# Altium project PROC114E3_SCH.PrjPcb (part 12 of 22)

## Sheet 26.SchDoc
size 513 x 386 mm
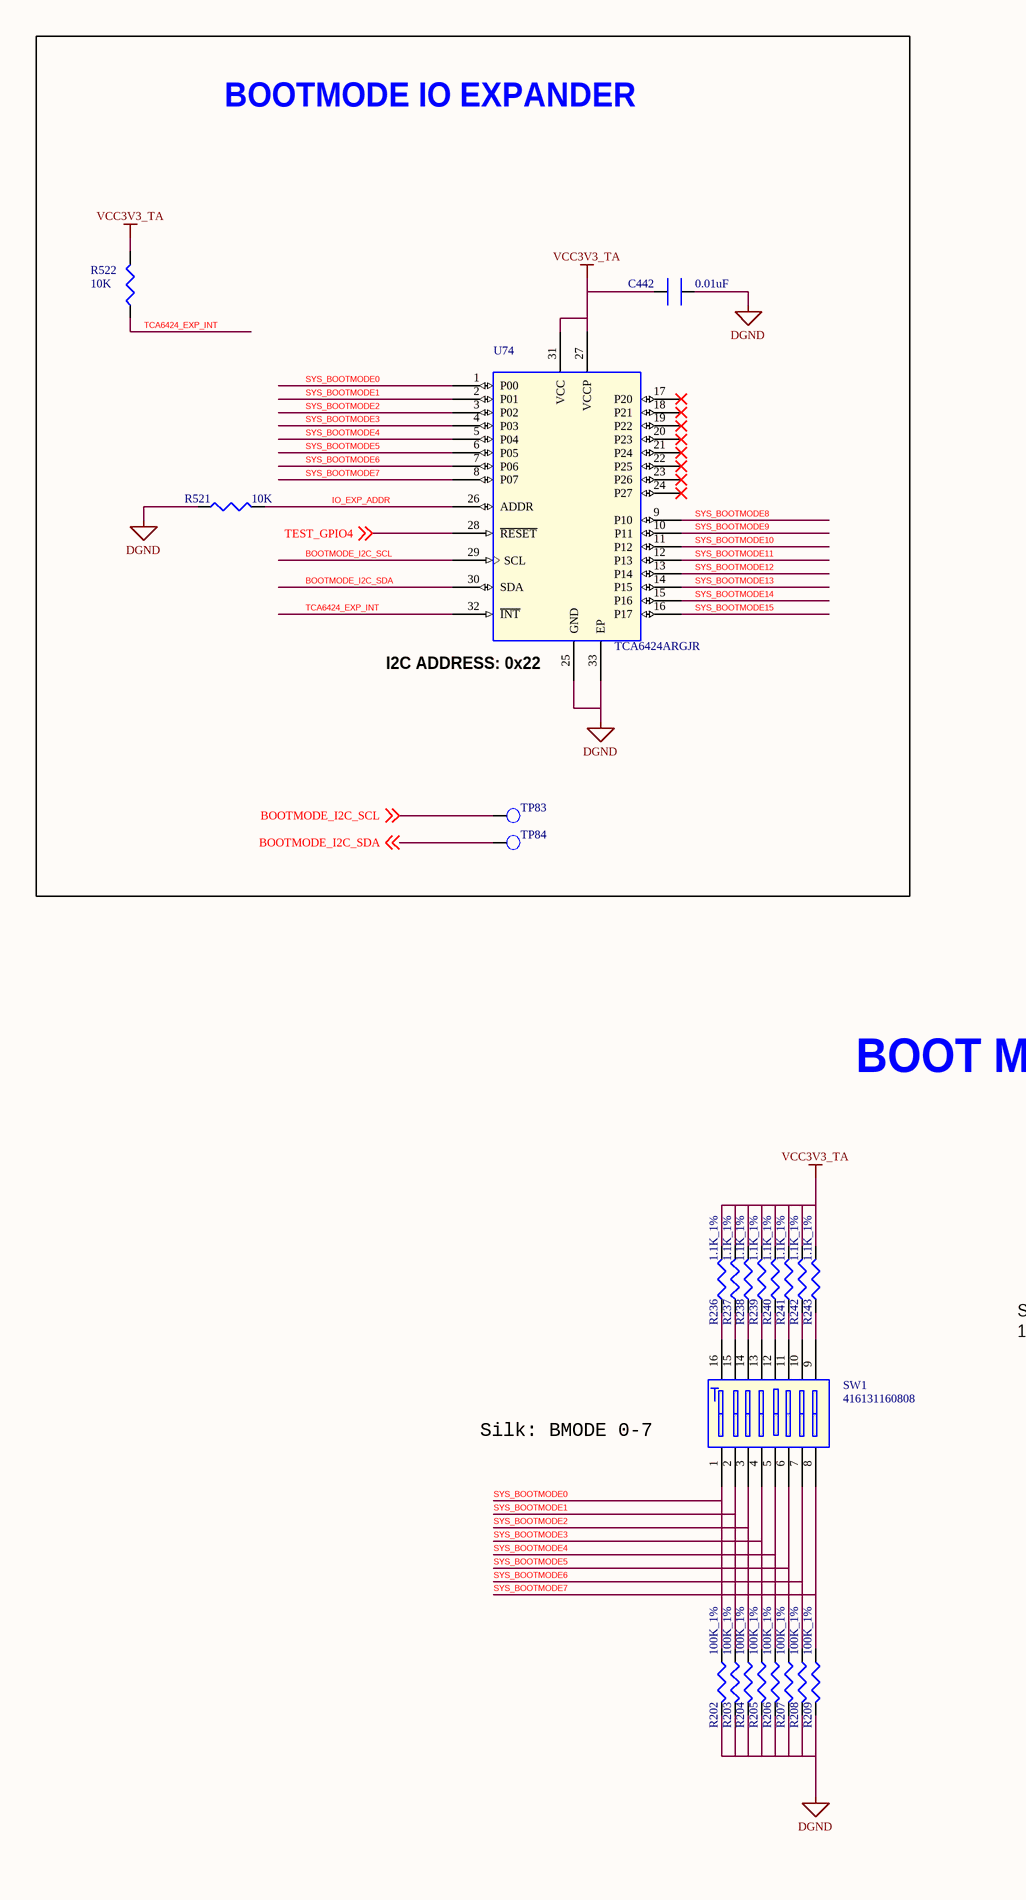
[diagram p41: 26.SchDoc, left]
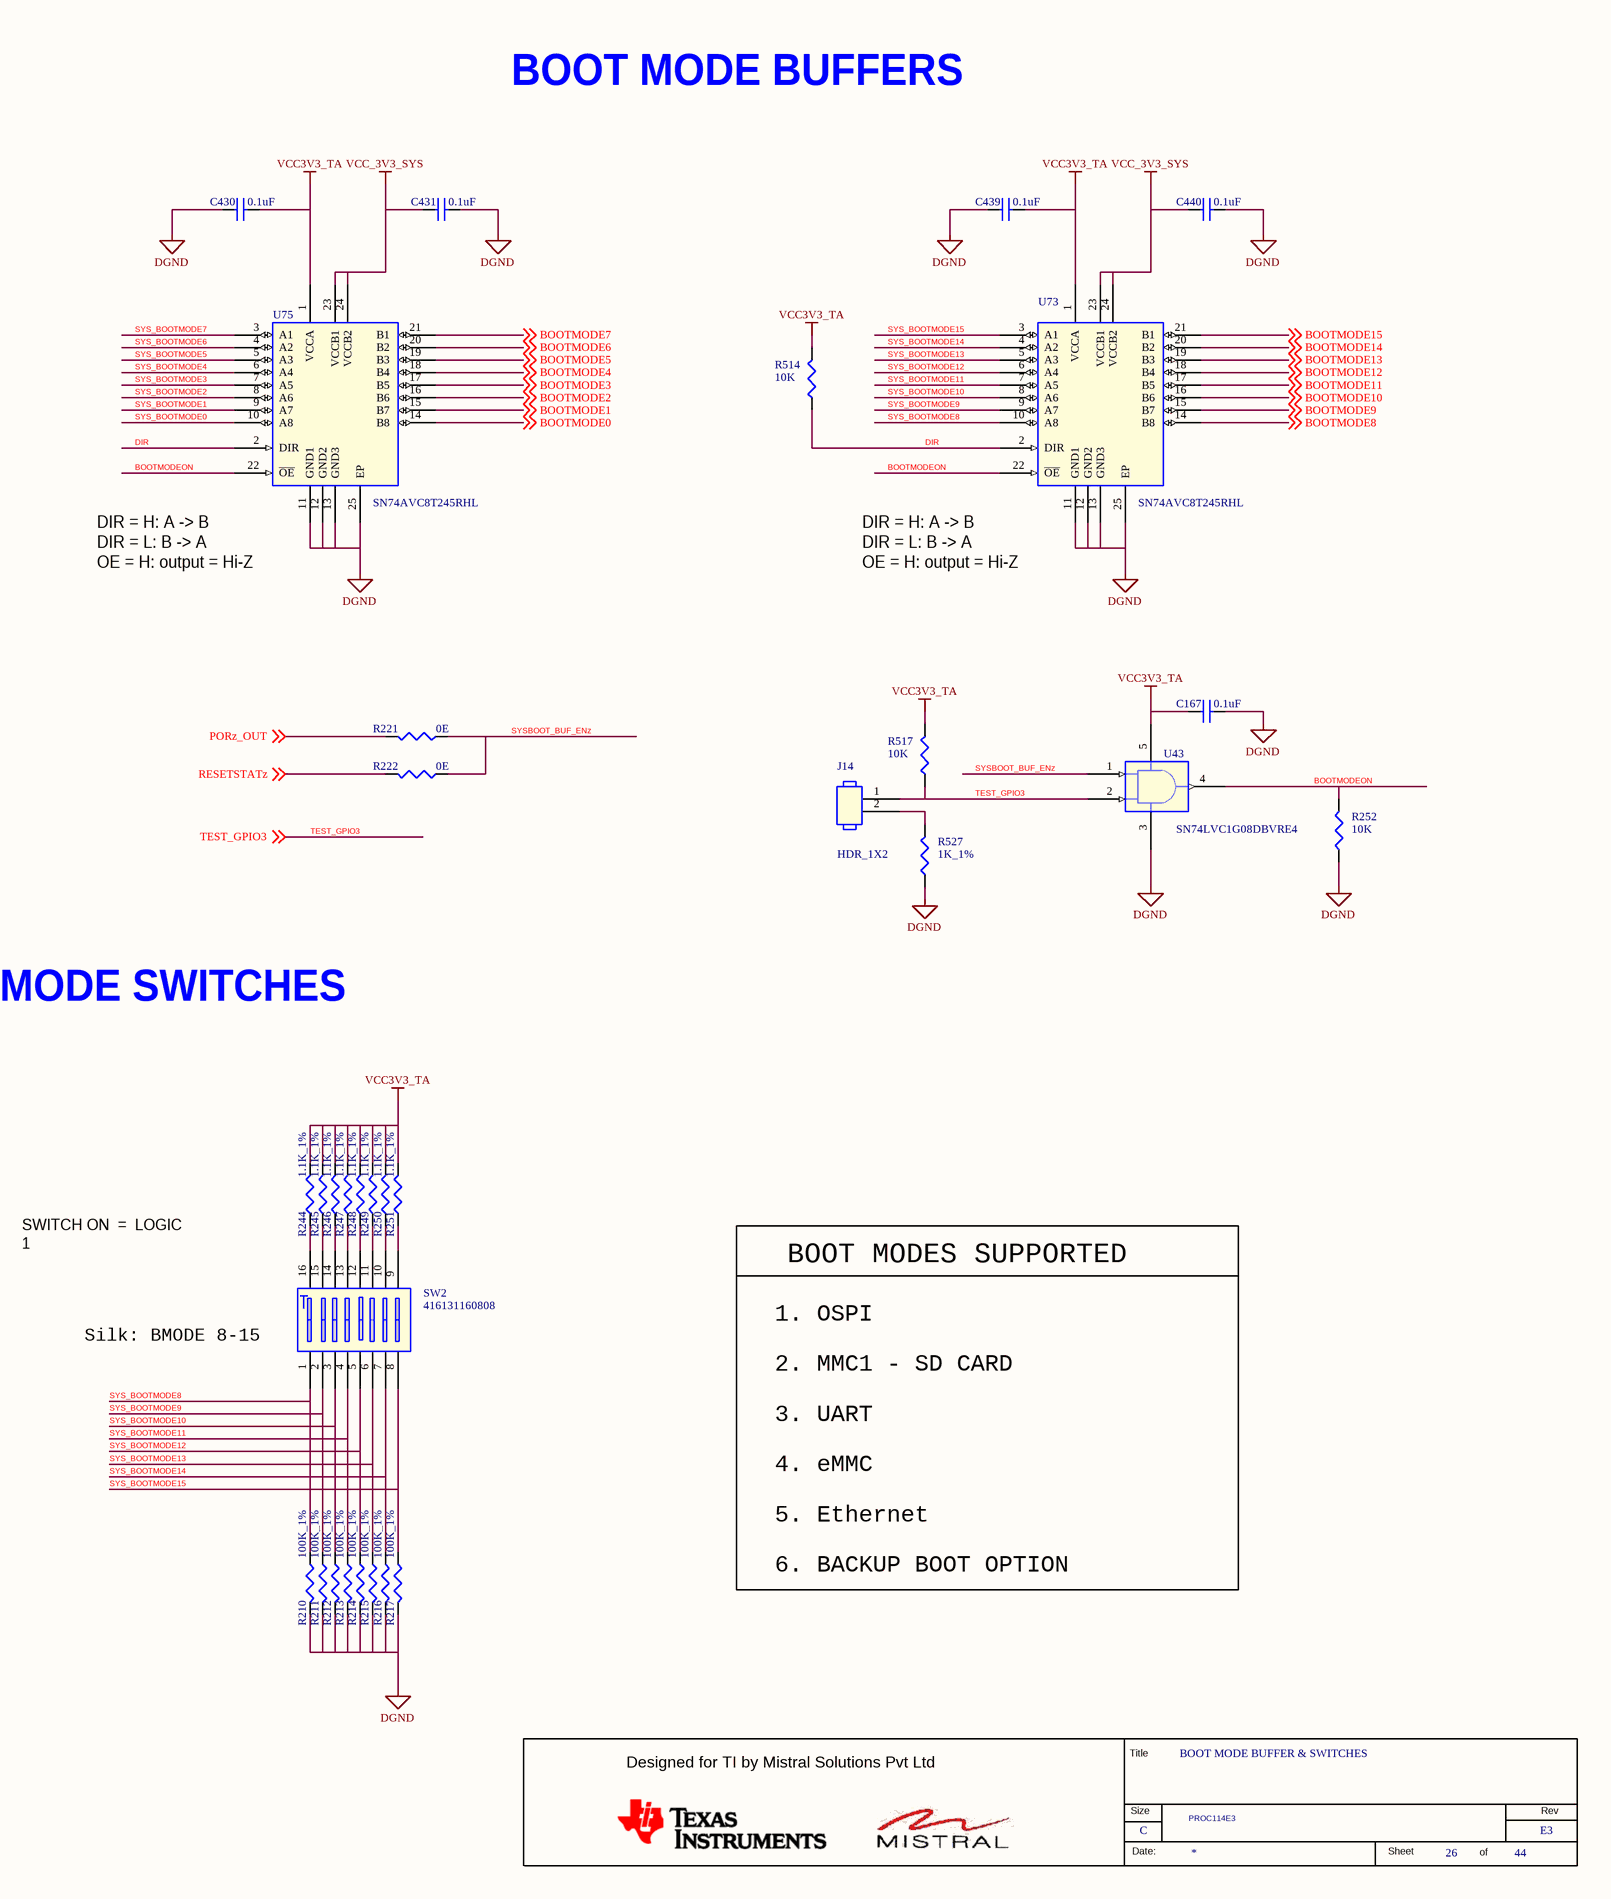
[diagram p42: 26.SchDoc, right]

### Parts
(Parts that share a designator on the sheet are numbered #1, #2 ... from top to bottom, then left to right.)
*#26  RevCode: E3  Title: BOOT MODE BUFFER & SWITCHES  Page Size: C  Page Number: 26  Page Count: 44  Variant Name: PROC114E3  (hidden comment: MISTRAL_TITLEBLK_CSIZE)  (graphical)
C167  0.1uF  [CAP0201_0-5]
C430  0.1uF  [CAP0201_0-5]
C431  0.1uF  [CAP0201_0-5]
C439  0.1uF  [CAP0201_0-5]
C440  0.1uF  [CAP0201_0-5]
C442  0.01uF  [CAP0402N]
J14  HDR_1X2  [HDR_1X2_90120-0122_S_T_5-6]
R202  100K_1%  [RES0201_0-5]
R203  100K_1%  [RES0201_0-5]
R204  100K_1%  [RES0201_0-5]
R205  100K_1%  [RES0201_0-5]
R206  100K_1%  [RES0201_0-5]
R207  100K_1%  [RES0201_0-5]
R208  100K_1%  [RES0201_0-5]
R209  100K_1%  [RES0201_0-5]
R210  100K_1%  [RES0201_0-5]
R211  100K_1%  [RES0201_0-5]
R212  100K_1%  [RES0201_0-5]
R213  100K_1%  [RES0201_0-5]
R214  100K_1%  [RES0201_0-5]
R215  100K_1%  [RES0201_0-5]
R216  100K_1%  [RES0201_0-5]
R217  100K_1%  [RES0201_0-5]
R221  0E  [RES0201_0-5]
R222  0E  [RES0402_0-5]
R236  1.1K_1%  [RES0201_0-5]
R237  1.1K_1%  [RES0201_0-5]
R238  1.1K_1%  [RES0201_0-5]
R239  1.1K_1%  [RES0201_0-5]
R240  1.1K_1%  [RES0201_0-5]
R241  1.1K_1%  [RES0201_0-5]
R242  1.1K_1%  [RES0201_0-5]
R243  1.1K_1%  [RES0201_0-5]
R244  1.1K_1%  [RES0201_0-5]
R245  1.1K_1%  [RES0201_0-5]
R246  1.1K_1%  [RES0201_0-5]
R247  1.1K_1%  [RES0201_0-5]
R248  1.1K_1%  [RES0201_0-5]
R249  1.1K_1%  [RES0201_0-5]
R250  1.1K_1%  [RES0201_0-5]
R251  1.1K_1%  [RES0201_0-5]
R252  10K  [RES0201_0-5]
R514  10K  [RES0201_0-5]
R517  10K  [RES0201_0-5]
R521  10K  [RES0201_0-5]
R522  10K  [RES0201_0-5]
R527  1K_1%  [RES0402_0-5]
SW1  416131160808  [SW16_416131160808_460X230_SMD_2-7]
SW2  416131160808  [SW16_416131160808_460X230_SMD_2-7]
TP83  TP20_SMD  [TP20_SMD]  (value not drawn)
TP84  TP20_SMD  [TP20_SMD]  (value not drawn)
U43  SN74LVC1G08DBVRE4  [SOT23-5]
U73  SN74AVC8T245RHL  [QFN24_19-68_220X140_1]
U74  TCA6424ARGJR  [QFN32_19-68_200X200]
U75  SN74AVC8T245RHL  [QFN24_19-68_220X140_1]

### Blocks framed on the sheet
BOOTMODE IO EXPANDER: C442 R521 R522 TP83 TP84 U74

### Nets
DGND: C167.2 C430.1 C431.2 C439.1 C440.2 C442.1 R202.2 R203.2 R204.2 R205.2 R206.2 R207.2 R208.2 R209.2 R210.2 R211.2 R212.2 R213.2 R214.2 R215.2 R216.2 R217.2 R252.1 R521.2 R527.1 U43.3(GND) U73.11(GND1) U73.12(GND2) U73.13(GND3) U73.25(EP) U74.25(GND) U74.33(EP) U75.11(GND1) U75.12(GND2) U75.13(GND3) U75.25(EP)
VCC3V3_TA: C167.1 C430.2 C439.2 C442.2 R236.2 R237.2 R238.2 R239.2 R240.2 R241.2 R242.2 R243.2 R244.2 R245.2 R246.2 R247.2 R248.2 R249.2 R250.2 R251.2 R514.2 R517.2 R522.2 U43.5(VCC) U73.1(VCCA) U74.27(VCCP) U74.31(VCC) U75.1(VCCA)
VCC_3V3_SYS: C431.1 C440.1 U73.23(VCCB1) U73.24(VCCB2) U75.23(VCCB1) U75.24(VCCB2)
BOOTMODE0: U75.14(B8) ; off-sheet BOOTMODE0
BOOTMODE1: U75.15(B7) ; off-sheet BOOTMODE1
BOOTMODE2: U75.16(B6) ; off-sheet BOOTMODE2
BOOTMODE3: U75.17(B5) ; off-sheet BOOTMODE3
BOOTMODE4: U75.18(B4) ; off-sheet BOOTMODE4
BOOTMODE5: U75.19(B3) ; off-sheet BOOTMODE5
BOOTMODE6: U75.20(B2) ; off-sheet BOOTMODE6
BOOTMODE7: U75.21(B1) ; off-sheet BOOTMODE7
BOOTMODE8: U73.14(B8) ; off-sheet BOOTMODE8
BOOTMODE9: U73.15(B7) ; off-sheet BOOTMODE9
BOOTMODE10: U73.16(B6) ; off-sheet BOOTMODE10
BOOTMODE11: U73.17(B5) ; off-sheet BOOTMODE11
BOOTMODE12: U73.18(B4) ; off-sheet BOOTMODE12
BOOTMODE13: U73.19(B3) ; off-sheet BOOTMODE13
BOOTMODE14: U73.20(B2) ; off-sheet BOOTMODE14
BOOTMODE15: U73.21(B1) ; off-sheet BOOTMODE15
BOOTMODE_I2C_SCL: TP83.1(TP) U74.29(SCL) ; off-sheet BOOTMODE_I2C_SCL
BOOTMODE_I2C_SDA: TP84.1(TP) U74.30(SDA) ; off-sheet BOOTMODE_I2C_SDA
BOOTMODEON: R252.2 U43.4(Y) U73.22(~{OE}) U75.22(~{OE})
DIR: R514.1 U73.2(DIR) U75.2(DIR)
IO_EXP_ADDR: R521.1 U74.26(ADDR)
PORz_OUT: R221.2 ; off-sheet PORz_OUT
RESETSTATz: R222.2 ; off-sheet RESETSTATz
SYS_BOOTMODE0: R202.1 SW1.1 U74.1(P00) U75.10(A8)
SYS_BOOTMODE1: R203.1 SW1.2 U74.2(P01) U75.9(A7)
SYS_BOOTMODE2: R204.1 SW1.3 U74.3(P02) U75.8(A6)
SYS_BOOTMODE3: R205.1 SW1.4 U74.4(P03) U75.7(A5)
SYS_BOOTMODE4: R206.1 SW1.5 U74.5(P04) U75.6(A4)
SYS_BOOTMODE5: R207.1 SW1.6 U74.6(P05) U75.5(A3)
SYS_BOOTMODE6: R208.1 SW1.7 U74.7(P06) U75.4(A2)
SYS_BOOTMODE7: R209.1 SW1.8 U74.8(P07) U75.3(A1)
SYS_BOOTMODE8: R210.1 SW2.1 U73.10(A8) U74.9(P10)
SYS_BOOTMODE9: R211.1 SW2.2 U73.9(A7) U74.10(P11)
SYS_BOOTMODE10: R212.1 SW2.3 U73.8(A6) U74.11(P12)
SYS_BOOTMODE11: R213.1 SW2.4 U73.7(A5) U74.12(P13)
SYS_BOOTMODE12: R214.1 SW2.5 U73.6(A4) U74.13(P14)
SYS_BOOTMODE13: R215.1 SW2.6 U73.5(A3) U74.14(P15)
SYS_BOOTMODE14: R216.1 SW2.7 U73.4(A2) U74.15(P16)
SYS_BOOTMODE15: R217.1 SW2.8 U73.3(A1) U74.16(P17)
SYSBOOT_BUF_ENz: R221.1 R222.1 U43.1(A)
TCA6424_EXP_INT: R522.1 U74.32(~{INT})
TEST_GPIO3: J14.1 R517.1 U43.2(B) ; off-sheet TEST_GPIO3
TEST_GPIO4: U74.28(~{RESET}) ; off-sheet TEST_GPIO4
NetJ14_2: J14.2 R527.2
NetR236_1: R236.1 SW1.16
NetR237_1: R237.1 SW1.15
NetR238_1: R238.1 SW1.14
NetR239_1: R239.1 SW1.13
NetR240_1: R240.1 SW1.12
NetR241_1: R241.1 SW1.11
NetR242_1: R242.1 SW1.10
NetR243_1: R243.1 SW1.9
NetR244_1: R244.1 SW2.16
NetR245_1: R245.1 SW2.15
NetR246_1: R246.1 SW2.14
NetR247_1: R247.1 SW2.13
NetR248_1: R248.1 SW2.12
NetR249_1: R249.1 SW2.11
NetR250_1: R250.1 SW2.10
NetR251_1: R251.1 SW2.9

Not connected (* = marked no-connect by the designer): U74 17(P20)* 18(P21)* 19(P22)* 20(P23)* 21(P24)* 22(P25)* 23(P26)* 24(P27)*

### Notes on the sheet
- BOOT MODE BUFFERS
- (near U75) DIR = H: A -> B
  DIR = L: B -> A
  OE = H: output = Hi-Z
- (near U73) DIR = H: A -> B
  DIR = L: B -> A
  OE = H: output = Hi-Z
- (near U74) I2C ADDRESS: 0x22
- BOOT MODE SWITCHES
- SWITCH ON  =  LOGIC 1
  SWITCH OFF =  LOGIC 0
- BOOT MODES SUPPORTED
- 1. OSPI
- Silk: BMODE 0-7
- Silk: BMODE 8-15
- 2. MMC1 - SD CARD
- 3. UART
- 4. eMMC
- 5. Ethernet
- 6. BACKUP BOOT OPTION
- (in symbol MISTRAL_TITLEBLK_CSIZE) Title; Designed for TI by Mistral Solutions Pvt Ltd; Size; Rev; Date:; Sheet; of

### Library data of the parts
*#26 = MISTRAL_TITLEBLK_CSIZE: Issue: 1.0; Page Create Date: March  8, 1995; Page Modify Date: *; Schematic Page Count: 44; Schematic Page Number: 26
C167 C430 C431 C440 = CAP_Dup2: as C325 on sheet 24; Tolerance: 10%; Voltage: 16V; Package: 0201; Distributor_name: DIGIKEY; Distributor_part_number: 490-14305-1-ND; Height: 0.33MM; Weight: 0.33mg; Temperature: -55°C+85°C; Datasheet: Y:\MIS_DATABASE\DATASHEETS\CAPACITORS\GRM033R61C104KE14.PDF; Crtd /date: MANIRAJA/230118; Chkd/date: MANIRAJA/230118; MECHANICAL 3D STEP FILE: CAP0201_0-5; Library Ref: CAP; Footprint Ref: CAP0201_0-5; Library Path: Y:\MIS_DATABASE\Library\ALTIUM_TOOL\SCHEMATICS_PARTS\MS_DISCRETE_Library.schlib; Footprint Path: Y:\MIS_DATABASE\Library\ALTIUM_TOOL\PCB_FOOTPRINTS\Altium_Footprint_Lib.PcbLib; PCB Footprint: CAP0201_0-5
C439 = CAP_Dup2: as C474 on sheet 25; Footprint Path: Y:\MIS_DATABASE\Library\ALTIUM_TOOL\PCB_FOOTPRINTS\Altium_Footprint_Lib.PcbLib; Library Path: Y:\MIS_DATABASE\Library\ALTIUM_TOOL\SCHEMATICS_PARTS\MS_DISCRETE_Library.schlib; Footprint Ref: CAP0201_0-5; Library Ref: CAP; MECHANICAL 3D STEP FILE: CAP0201_0-5; Chkd/date: MANIRAJA/230118; Crtd /date: MANIRAJA/230118; Datasheet: Y:\MIS_DATABASE\DATASHEETS\CAPACITORS\GRM033R61C104KE14.PDF; Temperature: -55°C+85°C; Weight: 0.33mg; Height: 0.33MM; Distributor_part_number: 490-14305-1-ND; Distributor_name: DIGIKEY; Package: 0201; Voltage: 16V; Tolerance: 10%; PCB Footprint: CAP0201_0-5
C442 = CAP_Dup3: CAP CERAMIC 0.01uF 25V 10% X5R 0201; Part_type: CAPACITORS\CERAMIC; Mfr_part_number: GRM033R61E103KA12J; Mfr_name: MURATA; Mistral Part No: 120018010007-R; PCB Footprint: CAP0201_0-5; Wattage: NA; Custom_Duty: 15%; Customs_HS_Code: 85322990; Project: TI_MAXIE_CPB; Footprint Path: Y:\MIS_DATABASE\Library\ALTIUM_TOOL\PCB_FOOTPRINTS\Altium_Footprint_Lib.PcbLib; Library Path: Y:\MIS_DATABASE\Library\ALTIUM_TOOL\SCHEMATICS_PARTS\MS_DISCRETE_Library.schlib; Footprint Ref: CAP0201_0-5; MECHANICAL 3D STEP FILE: CAP0201_0-5; Temperature: -55°C+85°C; Weight: 0.33mg; Chkd/date: MANIRAJA/230118; Crtd /date: MANIRAJA/230118; Datasheet: Y:\MIS_DATABASE\DATASHEETS\CAPACITORS\GRM033R61E103KA12.PDF; Height: 0.33MM; Distributor_part_number: GRM033R61E103KA12J-ND; Distributor_name: DIGIKEY; Package: 0201; Voltage: 25V; Tolerance: 10%; Library Ref: CAP
J14 = HEADER_2X1: CON HDR 1X2 2.54MM PITCH ST TH; Mistral Part No: 150012100005-R; Mfr_name: MOLEX; Mfr_part_number: 90120-0122; Part_type: CONNECTOR\HEADERS; Wattage: NA; Project: NPOL_FEP; Customs_HS_Code: 85369090; Custom_Duty: 24%; PCB Footprint: HDR_1X2_90120-0122_S_T_5-6; Footprint Ref: HDR_1X2_90120-0122_S_T_5-6; Library Ref: HEADER_2X1; Footprint Path: Y:\MIS_DATABASE\Library\ALTIUM_TOOL\PCB_FOOTPRINTS\Altium_Footprint_Lib.PcbLib; Library Path: Y:\MIS_DATABASE\Library\ALTIUM_TOOL\SCHEMATICS_PARTS\MS_CONNECTOR_Library.schlib; MECHANICAL 3D STEP FILE: HDR_1X2_90120-0122_S_T_5-6; Temperature: -55°C+125°C; Weight: 122mg; Voltage: NA; Tolerance: NA; Package: THRU-HOLE; Distributor_name: DIGIKEY; Distributor_part_number: WM8072-ND; Height: 5.60MM; Datasheet: Y:\MIS_DATABASE\DATASHEETS\CONNECTORS\90120-XX.PDF; Crtd /date: USMAN/031012; Chkd/date: NAVEED/210714
R202 R203 R205 R206 R208 R210 R212 R214 R217 = RESISTOR_Dup4: RES 100K 1/20W 1% 0201; Mistral Part No: 110009060005-R; Mfr_name: YAGEO AMERICA; Mfr_part_number: RC0201FR-07100KL; Part_type: RESISTORS\FIXED; Project: SD865_NANOSOM; Voltage: NA; Customs_HS_Code: 85332119; Custom_Duty: 15%; Footprint Path: Y:\MIS_DATABASE\Library\ALTIUM_TOOL\PCB_FOOTPRINTS\Altium_Footprint_Lib.PcbLib; Library Path: Y:\MIS_DATABASE\Library\ALTIUM_TOOL\SCHEMATICS_PARTS\MS_DISCRETE_Library.schlib; Footprint Ref: RES0201_0-5; Library Ref: RESISTOR; MECHANICAL 3D STEP FILE: RES0201_0-5; Tolerance: 1%; Wattage: 1/20W; Package: 0201; Distributor_name: DIGIKEY; Distributor_part_number: 311-100KMCT-ND; Height: 0.26MM; Weight: 9mg; Temperature: -55°C+125°C; Datasheet: Y:\MIS_DATABASE\DATASHEETS\RESISTORS\RCXXXXL-SER_MAR18.PDF; Crtd /date: ALVY/120520; Chkd/date: MANIRAJA/120520; PCB Footprint: RES0201_0-5
R204 R207 R209 R211 R213 R215 R216 = RESISTOR_Dup4: RES 100K 1/20W 1% 0201; Part_type: RESISTORS\FIXED; Mfr_part_number: RC0201FR-07100KL; Mfr_name: YAGEO AMERICA; Mistral Part No: 110009060005-R; Custom_Duty: 15%; Customs_HS_Code: 85332119; Voltage: NA; Project: SD865_NANOSOM; Chkd/date: MANIRAJA/120520; Crtd /date: ALVY/120520; Datasheet: Y:\MIS_DATABASE\DATASHEETS\RESISTORS\RCXXXXL-SER_MAR18.PDF; Temperature: -55°C+125°C; Weight: 9mg; Height: 0.26MM; Distributor_part_number: 311-100KMCT-ND; Distributor_name: DIGIKEY; Package: 0201; Wattage: 1/20W; Tolerance: 1%; MECHANICAL 3D STEP FILE: RES0201_0-5; Library Ref: RESISTOR; Footprint Ref: RES0201_0-5; Library Path: Y:\MIS_DATABASE\Library\ALTIUM_TOOL\SCHEMATICS_PARTS\MS_DISCRETE_Library.schlib; Footprint Path: Y:\MIS_DATABASE\Library\ALTIUM_TOOL\PCB_FOOTPRINTS\Altium_Footprint_Lib.PcbLib; PCB Footprint: RES0201_0-5
R221 = RESISTOR_Dup4: RES 0E 1/20W 5% 0201; Part_type: RESISTORS\FIXED; Mfr_part_number: RC0201JR-070RL; Mfr_name: YAGEO AMERICA; Mistral Part No: 110010070067-R; Custom_Duty: 15%; Customs_HS_Code: 85332119; Voltage: NA; Project: PB_BUGBASE; MECHANICAL 3D STEP FILE: RES0201_0-5; Chkd/date: NAVEED/301214; Crtd /date: MUDDU/120710; Datasheet: Y:\MIS_DATABASE\DATASHEETS\RESISTORS\RCXXXXL-SER_MAR18.PDF; Temperature: -55°C+125°C; Weight: 0.17mg; Height: 0.26MM; Distributor_part_number: 311-0.0NCT-ND; Distributor_name: DIGIKEY; Package: 0201; Wattage: 1/20W; Tolerance: 5%; Library Ref: RESISTOR; Footprint Ref: RES0201_0-5; Library Path: Y:\MIS_DATABASE\Library\ALTIUM_TOOL\SCHEMATICS_PARTS\MS_DISCRETE_Library.schlib; Footprint Path: Y:\MIS_DATABASE\Library\ALTIUM_TOOL\PCB_FOOTPRINTS\Altium_Footprint_Lib.PcbLib; PCB Footprint: RES0201_0-5
R222 = RESISTOR_Dup4: as R610 on sheet 25; MECHANICAL 3D STEP FILE: RES0402_0-5; Chkd/date: VASANTHA/201216; Crtd /date: MUDDU/190810; Datasheet: Y:\MIS_DATABASE\DATASHEETS\RESISTORS\CRCW0603.PDF; Temperature: -55°C+155°C; Weight: 0.65mg; Height: 0.40MM; Distributor_part_number: 541-0.0JCT-ND; Distributor_name: DIGIKEY; Package: 0402; Wattage: 1/16W; Tolerance: NA; Library Ref: RESISTOR; Footprint Ref: RES0402_0-5; Library Path: Y:\MIS_DATABASE\Library\ALTIUM_TOOL\SCHEMATICS_PARTS\MS_DISCRETE_Library.schlib; Footprint Path: Y:\MIS_DATABASE\Library\ALTIUM_TOOL\PCB_FOOTPRINTS\Altium_Footprint_Lib.PcbLib; PCB Footprint: RES0402_0-5
R236-R251 = RESISTOR_Dup4: RES 1.1K 1/20W 1% 0201; Part_type: RESISTORS\FIXED; Mfr_part_number: RMCF0201FT1K10; Mfr_name: STACKPOLE ELECTRONICS; Mistral Part No: 110021090018-R; Custom_Duty: 15%; Customs_HS_Code: 85332119; Voltage: NA; Project: TI_AM335x SK_BRD; Chkd/date: MANIRAJA/290921; Crtd /date: ALVY/280921; Datasheet: Y:\MIS_DATABASE\DATASHEETS\RESISTORS\RMCF-SER_JUL18.PDF; Temperature: -55°C+155°C; Weight: 0.16mg; Height: 0.26MM; Distributor_part_number: RMCF0201FT1K10CT-ND; Distributor_name: DIGIKEY; Package: 0201; Wattage: 1/20W; Tolerance: 1%; Library Ref: RESISTOR; Footprint Ref: RES0201_0-5; MECHANICAL 3D STEP FILE: RES0201_0-5; Library Path: Y:\MIS_DATABASE\Library\ALTIUM_TOOL\SCHEMATICS_PARTS\MS_DISCRETE_Library.schlib; Footprint Path: Y:\MIS_DATABASE\Library\ALTIUM_TOOL\PCB_FOOTPRINTS\Altium_Footprint_Lib.PcbLib; PCB Footprint: RES0201_0-5
R252 R514 R517 R521 R522 = RESISTOR_Dup6: as R162 on sheet 24; Footprint Path: Y:\MIS_DATABASE\Library\ALTIUM_TOOL\PCB_FOOTPRINTS\Altium_Footprint_Lib.PcbLib; Library Path: Y:\MIS_DATABASE\Library\ALTIUM_TOOL\SCHEMATICS_PARTS\MS_DISCRETE_Library.schlib; Footprint Ref: RES0201_0-5; Library Ref: RESISTOR; Tolerance: 5%; Wattage: 1/20W; Package: 0201; Distributor_name: DIGIKEY; Distributor_part_number: 311-10KNCT-ND; Height: 0.26MM; Weight: 0.17mg; Temperature: -55°C+125°C; Datasheet: Y:\MIS_DATABASE\DATASHEETS\RESISTORS\RCXXXXL-SER_MAR18.PDF; Crtd /date: MANIRAJA/050517; Chkd/date: MANIRAJA/050517; MECHANICAL 3D STEP FILE: RES0201_0-5; PCB Footprint: RES0201_0-5
R527 = RESISTOR_Dup4: RES 1K 1/10W 1% 0402; Part_type: RESISTORS\FIXED; Mfr_part_number: ERJ-2RKF1001X; Mfr_name: PANASONIC-ECG; Mistral Part No: 110009030411-R; Custom_Duty: 15%; Customs_HS_Code: 85332119; Voltage: NA; Project: VOCERA; Chkd/date: VASANTHA/281216; Crtd /date: MAZHAR/150506; Datasheet: Y:\MIS_DATABASE\DATASHEETS\RESISTORS\PAN-ERJSER_NOV17.PDF; Temperature: -55°C+155°C; Weight: 0.8mg; Height: 0.40MM; Distributor_part_number: P1.00KLCT-ND; Distributor_name: DIGIKEY; Package: 0402; Wattage: 1/10W; Tolerance: 1%; Library Ref: RESISTOR; Footprint Ref: RES0402_0-5; MECHANICAL 3D STEP FILE: RES0402_0-5; Library Path: Y:\MIS_DATABASE\Library\ALTIUM_TOOL\SCHEMATICS_PARTS\MS_DISCRETE_Library.schlib; Footprint Path: Y:\MIS_DATABASE\Library\ALTIUM_TOOL\PCB_FOOTPRINTS\Altium_Footprint_Lib.PcbLib; PCB Footprint: RES0402_0-5
SW1 = SW16_CHS-08A: SWITCH SLIDE SPST ST SMD; Part_type: ELECTRO-MECHANICAL\SWITCH; Mfr_name: WURTH ELECTRONICS; Mistral Part No: 130020100001-R; Custom_Duty: 24%; Customs_HS_Code: 85369090; Wattage: NA; Project: AM64X_SKEVM; Footprint Path: Y:\MIS_DATABASE\Library\ALTIUM_TOOL\PCB_FOOTPRINTS\Altium_Footprint_Lib.PcbLib; Library Path: Y:\MIS_DATABASE\Library\ALTIUM_TOOL\SCHEMATICS_PARTS\MS_SWITCH_Library.schlib; MECHANICAL 3D STEP FILE: SW16_416131160808_460X230_SMD_2-7; Chkd/date: MANIRAJA/051020; Crtd /date: ALVY/011020; Datasheet: Y:\MIS_DATABASE\DATASHEETS\MISC\SWITCHES\4161311608XX.PDF; Temperature: -40°C+85°C; Weight: 281.7mg; Height: 2.65MM; Library Ref: SW16_CHS-08A; Distributor_part_number: 732-3857-1-ND; Distributor_name: DIGIKEY; Package: SMD; Voltage: NA; Tolerance: NA; Mfr_part_number: 416131160808; Footprint Ref: SW16_416131160808_460X230_SMD_2-7; PCB Footprint: SW16_416131160808_460X230_SMD_2-7
SW2 = SW16_CHS-08A: SWITCH SLIDE SPST ST SMD; Mistral Part No: 130020100001-R; Mfr_name: WURTH ELECTRONICS; Part_type: ELECTRO-MECHANICAL\SWITCH; Project: AM64X_SKEVM; Tolerance: NA; Customs_HS_Code: 85369090; Custom_Duty: 24%; Footprint Ref: SW16_416131160808_460X230_SMD_2-7; Mfr_part_number: 416131160808; Voltage: NA; Wattage: NA; Package: SMD; Distributor_name: DIGIKEY; Distributor_part_number: 732-3857-1-ND; Library Ref: SW16_CHS-08A; Height: 2.65MM; Weight: 281.7mg; Temperature: -40°C+85°C; Datasheet: Y:\MIS_DATABASE\DATASHEETS\MISC\SWITCHES\4161311608XX.PDF; Crtd /date: ALVY/011020; Chkd/date: MANIRAJA/051020; MECHANICAL 3D STEP FILE: SW16_416131160808_460X230_SMD_2-7; Library Path: Y:\MIS_DATABASE\Library\ALTIUM_TOOL\SCHEMATICS_PARTS\MS_SWITCH_Library.schlib; Footprint Path: Y:\MIS_DATABASE\Library\ALTIUM_TOOL\PCB_FOOTPRINTS\Altium_Footprint_Lib.PcbLib; PCB Footprint: SW16_416131160808_460X230_SMD_2-7
TP83 TP84 = TESTPOINT: TESTPOINT CIR 20 SMD; Mfr_name: LOCAL; Mistral Part No: NA; Project: BT MODULE_CSRBC04; RoHS: NA; Footprint Ref: TP20_SMD; Library Ref: TESTPOINT; Chkd/date: SHREESHAIL/171006; Crtd /date: MAZHAR/171006; Height: NA; Distributor_part_number: NA; Distributor_name: NA; Package: SMD; Part_type: TESTPOINT; Mfr_part_number: TP20_SMD; Tolerance: NA; Voltage: NA; Wattage: NA; Weight: NA; Temperature: NA; Datasheet: NA; MECHANICAL 3D STEP FILE: NA; Library Path: Y:\MIS_DATABASE\Library\ALTIUM_TOOL\SCHEMATICS_PARTS\MS_DISCRETE_Library.schlib; Footprint Path: Y:\MIS_DATABASE\Library\ALTIUM_TOOL\PCB_FOOTPRINTS\Altium_Footprint_Lib.PcbLib; Customs_HS_Code: NA; Custom_Duty: NA; PCB Footprint: TP20_SMD
U43 = SN74LVC1G08DBVRE4_SOT23-5: IC SINGLE 2-INPUT POSITIVE AND GATE SOT23-5; Mistral Part No: 141009060026-R; Mfr_name: TEXAS INSTRUMENTS; Part_type: ICS\DIGITAL\GATES; Project: KHAN_MAIN; Customs_HS_Code: 85423100; Custom_Duty: 15%; Mfr_part_number: SN74LVC1G08DBVRE4; Package: SOT23-5; Distributor_name: DIGIKEY; Distributor_part_number: SN74LVC1G08DBVRE4-ND; Library Ref: SN74LVC1G08DBVRE4_SOT23-5; Height: 1.45MM; Temperature: -40°C+85°C; Datasheet: Y:\MIS_DATABASE\DATASHEETS\ICS\DIGITAL\GATES\SN74LVC1G08.PDF; Crtd /date: USMAN/151008; Chkd/date: SUHAS/221010; RoHS: Sb/ Br FREE; PCB Footprint: SOT23-5
U73 = SN74AVC8T245RHL_QFN24: IC BUS TRANSCEIVER 8-BIT DUAL-SUPPLY QFN24; Mistral Part No: 143011040001-R; Mfr_name: TEXAS INSTRUMENTS; Mfr_part_number: SN74AVC8T245RHLR; Part_type: ICS\TELECOM\TRANSCEIVER; Project: OMAPL1_PEC20; Tolerance: NA; Customs_HS_Code: 85423100; Custom_Duty: 15%; Library Ref: SN74AVC8T245RHL_QFN24; Voltage: NA; Wattage: NA; Package: QFN24; Distributor_name: DIGIKEY; Distributor_part_number: 296-17859-1-ND; Height: 1.00MM; Weight: NA; Temperature: -40°C+85°C; Datasheet: Y:\MIS_DATABASE\DATASHEETS\ICS\DIGITAL\BUSTRANSCEIVER\SN74AVC8T245.PDF; Crtd /date: BAVISH/290411; Chkd/date: VASANTHA/231216; MECHANICAL 3D STEP FILE: QFN24_19-68_220X140_1; PCB Footprint: QFN24_19-68_220X140_1
U74 = TCA6424ARGJR_QFN32: IC I2C I/O EXPANDER 24B UQFN32; Part_type: ICS\DIGITAL\BUSTRANSCEIVER; Mfr_name: TEXAS INSTRUMENTS; Mistral Part No: 141014090009-R; Custom_Duty: 15%; Customs_HS_Code: 85423100; Project: ZK_BIOMETRIC; Library Ref: TCA6424ARGJR_QFN32; Chkd/date: NAVEED/100715; Crtd /date: NAVEED/100914; Datasheet: Y:\MIS_DATABASE\DATASHEETS\ICS\DIGITAL\BUSTRANSCEIVER\TCA6424AR.PDF; Temperature: -40°C+85°C; Weight: NA; Height: 0.60MM; Distributor_part_number: 296-27844-1-ND; Distributor_name: DIGIKEY; Package: UQFN32; Mfr_part_number: TCA6424ARGJR; PCB Footprint: QFN32_19-68_200X200
U75 = SN74AVC8T245RHL_QFN24: IC BUS TRANSCEIVER 8-BIT DUAL-SUPPLY QFN24; Part_type: ICS\TELECOM\TRANSCEIVER; Mfr_part_number: SN74AVC8T245RHLR; Mfr_name: TEXAS INSTRUMENTS; Mistral Part No: 143011040001-R; Custom_Duty: 15%; Customs_HS_Code: 85423100; Wattage: NA; Project: OMAPL1_PEC20; MECHANICAL 3D STEP FILE: QFN24_19-68_220X140_1; Chkd/date: VASANTHA/231216; Crtd /date: BAVISH/290411; Datasheet: Y:\MIS_DATABASE\DATASHEETS\ICS\DIGITAL\BUSTRANSCEIVER\SN74AVC8T245.PDF; Temperature: -40°C+85°C; Weight: NA; Height: 1.00MM; Distributor_part_number: 296-17859-1-ND; Distributor_name: DIGIKEY; Package: QFN24; Voltage: NA; Tolerance: NA; Library Ref: SN74AVC8T245RHL_QFN24; PCB Footprint: QFN24_19-68_220X140_1